# Altium schematic sheet STM.SchDoc
size 420 x 297 mm
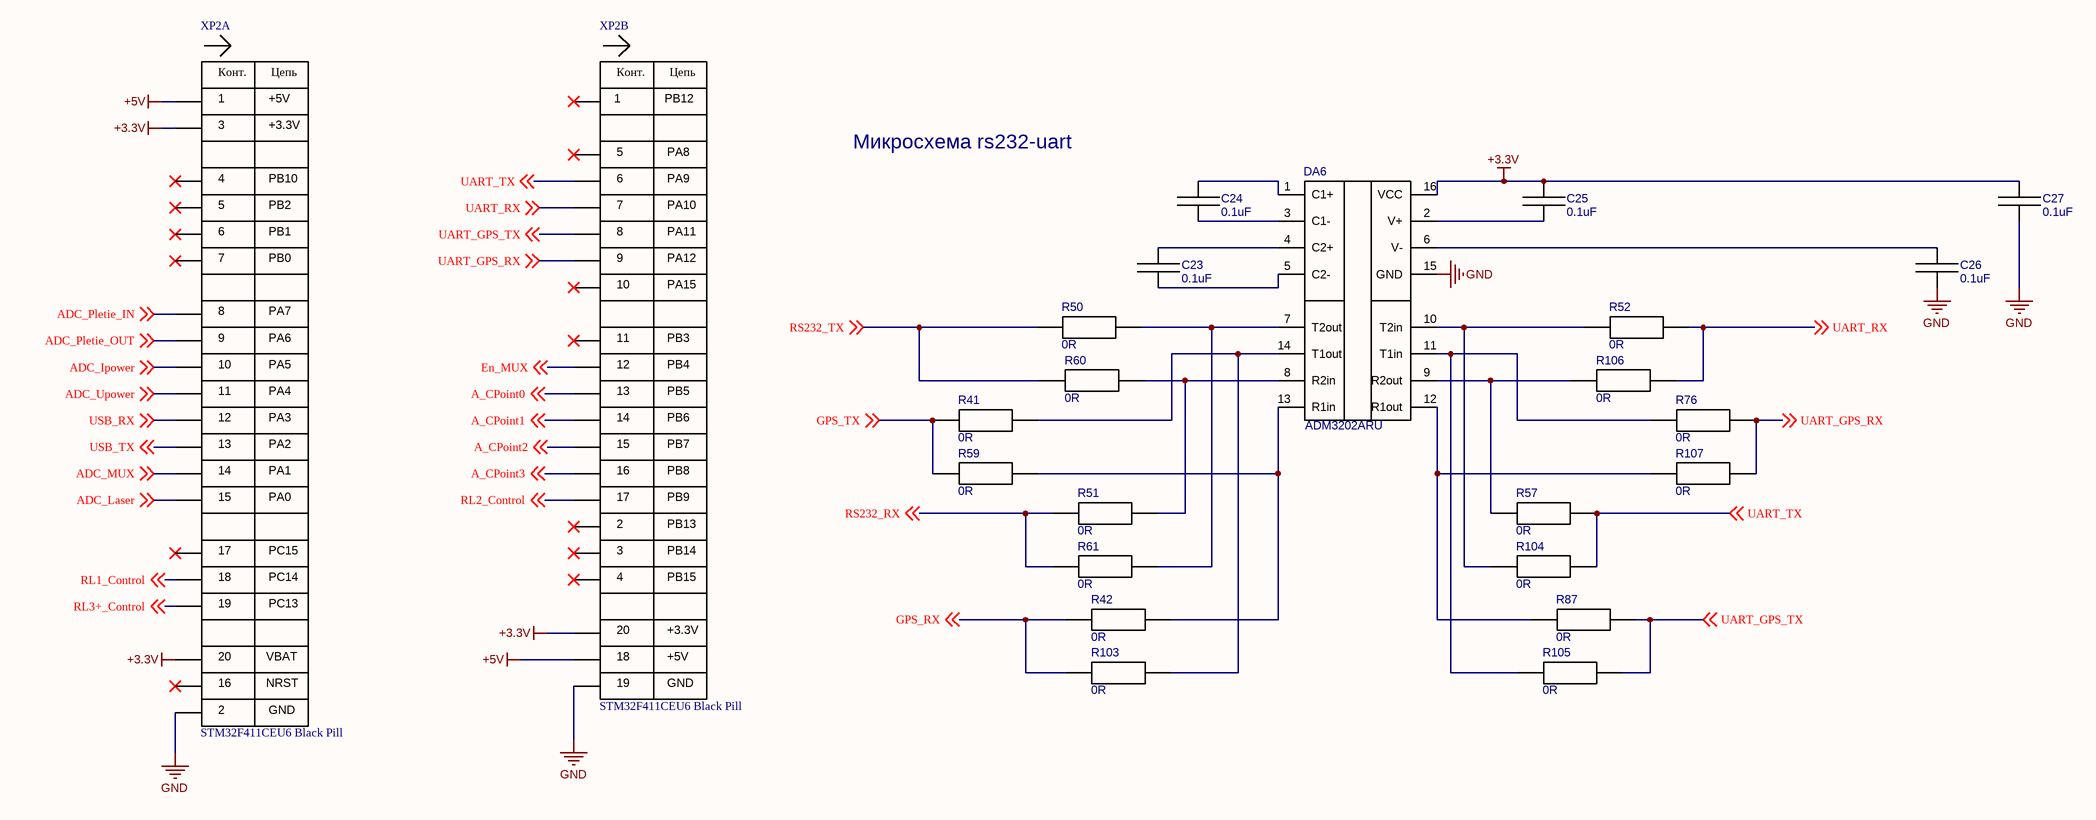
[diagram p0: STM.SchDoc]

## Parts
C23  0.1uF  [0603C]
C24  0.1uF  [0603C]
C25  0.1uF  [0603C]
C26  0.1uF  [0603C]
C27  0.1uF  [0603C]
DA6  ADM3202ARU  [TSSOP-16]
R41  0R  [R0402]
R42  0R  [R0402]
R50  0R  [R0402]
R51  0R  [R0402]
R52  0R  [R0402]
R57  0R  [R0402]
R59  0R  [R0402]
R60  0R  [R0402]
R61  0R  [R0402]
R76  0R  [R0402]
R87  0R  [R0402]
R103  0R  [R0402]
R104  0R  [R0402]
R105  0R  [R0402]
R106  0R  [R0402]
R107  0R  [R0402]
XP2  STM32F411CEU6 Black Pill  [Black pill STM32F411CEU6]  (parts A,B of 2)

## Nets
+3.3V: C25.2 C27.2 DA6.16(VCC) XP2.3(+3.3V) XP2.20(VBAT) XP2.40(+3.3V)
+5V: XP2.1(+5V) XP2.38(+5V)
GND: C26.1 C27.1 DA6.15(GND) XP2.2(GND) XP2.39(GND)
A_CPoint0: XP2.33(PB5) ; off-sheet A_CPoint0
A_CPoint1: XP2.34(PB6) ; off-sheet A_CPoint1
A_CPoint2: XP2.35(PB7) ; off-sheet A_CPoint2
A_CPoint3: XP2.36(PB8) ; off-sheet A_CPoint3
ADC_Ipower: XP2.10(PA5) ; off-sheet ADC_Ipower
ADC_Laser: XP2.15(PA0) ; off-sheet ADC_Laser
ADC_MUX: XP2.14(PA1) ; off-sheet ADC_MUX
ADC_Pletie_IN: XP2.8(PA7) ; off-sheet ADC_Pletie_IN
ADC_Pletie_OUT: XP2.9(PA6) ; off-sheet ADC_Pletie_OUT
ADC_Upower: XP2.11(PA4) ; off-sheet ADC_Upower
En_MUX: XP2.32(PB4) ; off-sheet En_MUX
GPS_RX: R42.1 R103.1 ; off-sheet GPS_RX
GPS_TX: R41.1 R59.1 ; off-sheet GPS_TX
RL1_Control: XP2.18(PC14) ; off-sheet RL1_Control
RL2_Control: XP2.37(PB9) ; off-sheet RL2_Control
RL3+_Control: XP2.19(PC13) ; off-sheet RL3+_Control
RS232_RX: R51.1 R61.1 ; off-sheet RS232_RX
RS232_TX: R50.1 R60.1 ; off-sheet RS232_TX
UART_GPS_RX: R76.2 R107.2 XP2.29(PA12) ; off-sheet UART_GPS_RX
UART_GPS_TX: R87.2 R105.2 XP2.28(PA11) ; off-sheet UART_GPS_TX
UART_RX: R52.2 R106.2 XP2.27(PA10) ; off-sheet UART_RX
UART_TX: R57.2 R104.2 XP2.26(PA9) ; off-sheet UART_TX
USB_RX: XP2.12(PA3) ; off-sheet USB_RX
USB_TX: XP2.13(PA2) ; off-sheet USB_TX
NetC23_1: C23.1 DA6.5(C2-)
NetC23_2: C23.2 DA6.4(C2+)
NetC24_1: C24.1 DA6.3(C1-)
NetC24_2: C24.2 DA6.1(C1+)
NetC25_1: C25.1 DA6.2(V+)
NetC26_2: C26.2 DA6.6(V-)
NetDA6_7: DA6.7(T2out) R50.2 R61.2
NetDA6_8: DA6.8(R2in) R51.2 R60.2
NetDA6_9: DA6.9(R2out) R57.1 R106.1
NetDA6_10: DA6.10(T2in) R52.1 R104.1
NetDA6_11: DA6.11(T1in) R76.1 R105.1
NetDA6_12: DA6.12(R1out) R87.1 R107.1
NetDA6_13: DA6.13(R1in) R42.2 R59.2
NetDA6_14: DA6.14(T1out) R41.2 R103.2

Not connected (* = marked no-connect by the designer): XP2 4(PB10)* 5(PB2)* 6(PB1)* 7(PB0)* 16(NRST)* 17(PC15)* 21(PB12)* 22(PB13)* 23(PB14)* 24(PB15)* 25(PA8)* 30(PA15)* 31(PB3)*

## Notes on the sheet
- Микросхема rs232-uart
- Подп. и дата
- Инв.№ дубл.
- Взам.инв.№
- Подп.и дата
- Инв.№ подл.
- Изм.
- Лист
- № докум.
- Подп.
- Дата
- Формат  A3
- (in symbol STM32F411CEU6 Black pil, part A) Конт.; Цепь
- (in symbol STM32F411CEU6 Black pil, part B) Конт.; Цепь

## Library data of the parts
C23-C27 = C0603-0.1UF 10% 50V: C0603 0.1UF 10% 50V; Part Number: SMD CAP CER 0.1UF ±10% 50V X7R 0603; Added_by: anton@teslatec.ru; Solder_Amount: 2; Pkg: 0603; Created_at: 10/01/2023; MountType: SMD; Mount: MOUNT
DA6 = ADM3202ARU: Low Power, 3.3 V, RS-232 / Line Drivers/Receivers; Added_by: irdolgopolowa@yandex.ru; Solder_Amount: 16; Created_at: 29/10/24; Mount: MOUNT; MountType: SMD; Part Number: ADM3202ARU; Pkg: TSSOP-16
R41 R42 R50-R52 R57 R59-R61 R76 R87 R103-R107 = R0402-0R: Resistor SMD 0R 1% 0402; Part Number: SMD RES 0R 0402; Added_by: irdolgopolowa@yandex.ru; Solder_Amount: 2; Pkg: 0402; Created_at: 29/10/24; MountType: SMD; Mount: MOUNT
XP2 = STM32F411CEU6 Black pil: Mating Part: 2*DS1021-1*20SF11-B; Added_by: irdolgopolowa@yandex.ru; Solder_Amount: 20; Created_at: 29/10/24; Mount: MOUNT; MountType: THM; Pkg: Black pil; Part Number: STM32F411CEU6 Black Pill